# EAGLE design CCM_0008 (EAGLE 9.5.1)
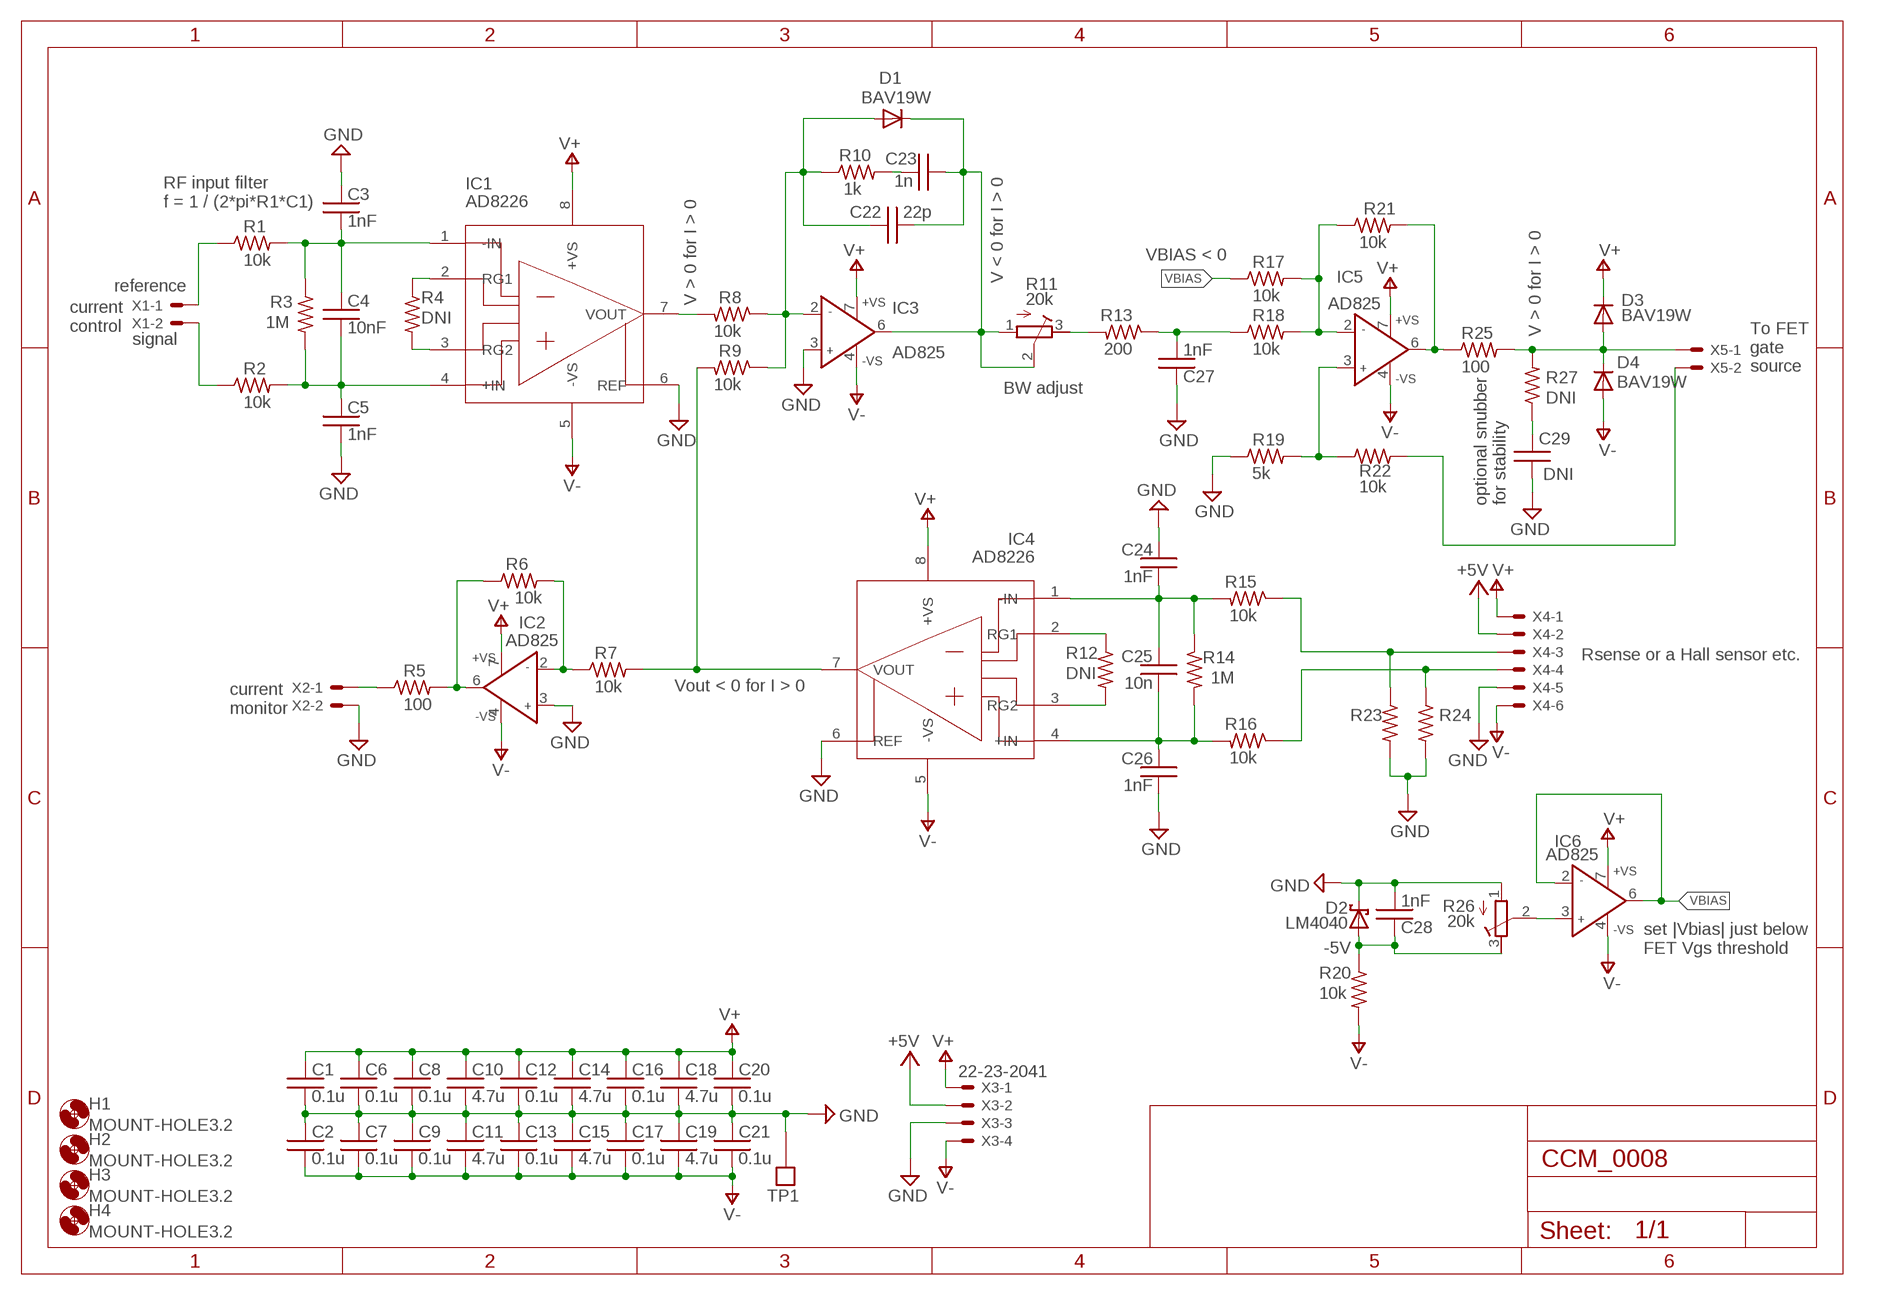
[diagram p0: schematic, sheet 1]

## Parts
C1  0.1u  C0603  [0603]
C2  0.1u  C0603  [0603]
C3  1nF  C0603  [0603]
C4  10nF  C0603  [0603]
C5  1nF  C0603  [0603]
C6  0.1u  C0603  [0603]
C7  0.1u  C0603  [0603]
C8  0.1u  C0603  [0603]
C9  0.1u  C0603  [0603]
C10  4.7u  C0603  [0603]
C11  4.7u  C0603  [0603]
C12  0.1u  C0603  [0603]
C13  0.1u  C0603  [0603]
C14  4.7u  C0603  [0603]
C15  4.7u  C0603  [0603]
C16  0.1u  C0603  [0603]
C17  0.1u  C0603  [0603]
C18  4.7u  C0603  [0603]
C19  4.7u  C0603  [0603]
C20  0.1u  C0603  [0603]
C21  0.1u  C0603  [0603]
C22  22p  C0603  [0603]
C23  1n  C0603  [0603]
C24  1nF  C0603  [0603]
C25  10n  C0603  [0603]
C26  1nF  C0603  [0603]
C27  1nF  C0603  [0603]
C28  1nF  C0603  [0603]
C29  DNI  C0603  [0603]
D1  BAV19W  DIODE-SOD123  [SOD123]
D2  LM4040  [SOT23]
D3  BAV19W  DIODE-SOD123  [SOD123]
D4  BAV19W  DIODE-SOD123  [SOD123]
H1  MOUNT-HOLE3.2  [3,2]
H2  MOUNT-HOLE3.2  [3,2]
H3  MOUNT-HOLE3.2  [3,2]
H4  MOUNT-HOLE3.2  [3,2]
IC1  AD8226  [SO08]
IC2  AD825  AD825_BR  [SO8]
IC3  AD825  AD825_BR  [SO8]
IC4  AD8226  [SO08]
IC5  AD825  AD825_BR  [SO8]
IC6  AD825  AD825_BR  [SO8]
R1  10k  R0603  [0603]
R2  10k  R0603  [0603]
R3  1M  R0603  [0603]
R4  DNI  R0603  [0603]
R5  100  R0603  [0603]
R6  10k  R0603  [0603]
R7  10k  R0603  [0603]
R8  10k  R0603  [0603]
R9  10k  R0603  [0603]
R10  1k  R0603  [0603]
R11  20k  R-TRIMM3224W  [RTRIM3224W]
R12  DNI  R0603  [0603]
R13  200  R0603  [0603]
R14  1M  R0603  [0603]
R15  10k  R0603  [0603]
R16  10k  R0603  [0603]
R17  10k  R0603  [0603]
R18  10k  R0603  [0603]
R19  5k  R0603  [0603]
R20  10k  R0603  [0603]
R21  10k  R0603  [0603]
R22  10k  R0603  [0603]
R23  ***  R0603  [0603]
R24  ***  R0603  [0603]
R25  100  R0603  [0603]
R26  20k  R-TRIMM3224W  [RTRIM3224W]
R27  DNI  R0603  [0603]
TP1  TESTPOINT  [TESTPOINT]
X1  22-23-2021  [22-23-2021]
X2  22-23-2021  [22-23-2021]
X3  22-23-2041  [22-23-2041]
X4  22-23-2061  [22-23-2061]
X5  22-23-2021  [22-23-2021]

## Nets
+5V: X3.2 X4.2
GND: C1.2 C2.1 C3.1 C5.2 C6.2 C7.1 C8.2 C9.1 C10.2 C11.1 C12.2 C13.1 C14.2 C15.1 C16.2 C17.1 C18.2 C19.1 C20.2 C21.1 C24.1 C26.2 C27.1 C28.2 C29.2 D2.1(C) IC1.6(REF) IC2.3(IN+) IC3.3(IN+) IC4.6(REF) R19.1 R23.2 R24.2 R26.1(A) TP1.P$1 X2.2 X3.3 X4.5
N$1: R2.1 X1.2
N$2: R1.1 X1.1
N$3: C22.1 C23.1 D1.C IC3.6(OUT) R11.1(A) R11.2(S)
N$4: IC1.2(RG1) R4.1
N$5: C3.2 C4.1 IC1.1(-IN) R1.2 R3.1
N$6: C4.2 C5.1 IC1.4(+IN) R2.2 R3.2
N$7: R5.1 X2.1
N$8: IC1.3(RG2) R4.2
N$9: IC2.6(OUT) R5.2 R6.1
N$10: IC2.2(IN-) R6.2 R7.1
N$11: IC5.3(IN+) R19.2 R22.1
N$12: IC4.7(VOUT) R7.2 R9.2
N$13: C27.2 R13.1 R18.1
N$14: IC5.2(IN-) R17.2 R18.2 R21.1
N$15: IC1.7(VOUT) R8.2
N$16: IC5.6(OUT) R21.2 R25.1
N$17: R11.3(E) R13.2
N$18: R22.2 X5.2
N$19: D3.A D4.C R25.2 R27.2 X5.1
N$20: C28.1 D2.2(A) R20.1 R26.3(E)
N$21: R16.1 R24.1 X4.4
N$22: IC6.3(IN+) R26.2(S)
N$23: IC4.2(RG1) R12.1
N$24: IC4.3(RG2) R12.2
N$25: C24.2 C25.1 IC4.1(-IN) R14.1 R15.2
N$26: C25.2 C26.1 IC4.4(+IN) R14.2 R16.2
N$27: R15.1 R23.1 X4.3
N$28: C29.1 R27.1
N$30: C23.2 R10.2
N$33: C22.2 D1.A IC3.2(IN-) R8.1 R9.1 R10.1
V+: C1.1 C6.1 C8.1 C10.1 C12.1 C14.1 C16.1 C18.1 C20.1 D3.C IC1.8(+VS) IC2.7(+VS) IC3.7(+VS) IC4.8(+VS) IC5.7(+VS) IC6.7(+VS) X3.1 X4.1
V-: C2.2 C7.2 C9.2 C11.2 C13.2 C15.2 C17.2 C19.2 C21.2 D4.A IC1.5(-VS) IC2.4(-VS) IC3.4(-VS) IC4.5(-VS) IC5.4(-VS) IC6.4(-VS) R20.2 X3.4 X4.6
VBIAS: IC6.2(IN-) IC6.6(OUT) R17.1

## Notes on the sheet
- RF input filter 
  f = 1 / (2*pi*R1*C1)
- VBIAS < 0
- V < 0 for I > 0
- reference
- V > 0 for I > 0
- current
  control
- V > 0 for I > 0
- signal
- To FET
  gate
  source
- BW adjust
- optional snubber
  for stability
- Rsense or a Hall sensor etc.
- Vout < 0 for I > 0
- current
  monitor
- -5V
- set |Vbias| just below 
  FET Vgs threshold

## Library data of the parts
C1-C29 = acrooptics:C: Capacitor
D1 D3 D4 = AquariumLibrary:DIODE-: DIODE
D2 = noah:LM4040: LM4040 Reference Zener Diode
H1-H4 = holes:MOUNT-HOLE: MOUNTING HOLE with drill center marker
IC1 IC4 = noah:AD8226
IC2 IC3 IC5 IC6 = noah:AD825_B: Low Cost, General-Purpose High Speed JFET Amplifier Source: http://www.analog.com/static/imported-files/data_sheets/AD825.pdf; MF: ALTERA CORPORATION; MPN: AD825ARZ; OC_FARNELL: 9603735; OC_NEWARK: 59K6528
R1-R10 R12-R25 R27 = acrooptics:R: 0603 resistor
R11 R26 = resistor:R-TRIMM: Trimm resistor
TP1 = Fitch:TESTPOINT
X1 X2 X5 = con-molex:22-23-2021: .100" (2.54mm) Center Header - 2 Pin; MF: MOLEX; MPN: 22-23-2021; OC_FARNELL: 1462926; OC_NEWARK: 25C3832
X3 = con-molex:22-23-2041: .100" (2.54mm) Center Header - 4 Pin; MF: MOLEX; MPN: 22-23-2041; OC_FARNELL: 1462920; OC_NEWARK: 38C0355
X4 = con-molex:22-23-2061: .100" (2.54mm) Center Header - 6 Pin; MF: MOLEX; MPN: 22-23-2061; OC_FARNELL: 1462922; OC_NEWARK: 27C1933

## Net classes
1 standard: width 0.61 mm, clearance 0.254 mm

## Board
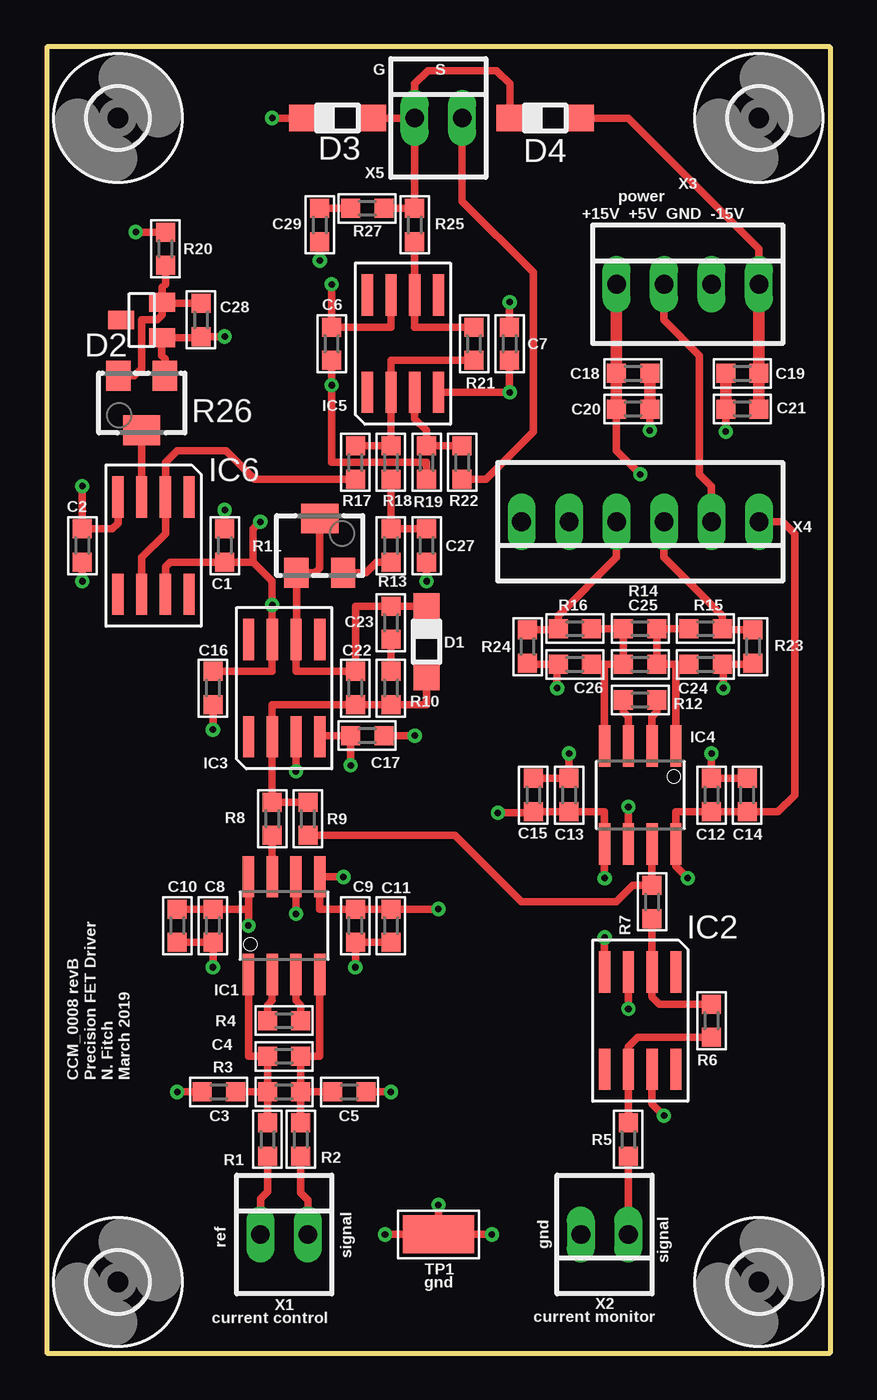
[diagram p1: board, top side]
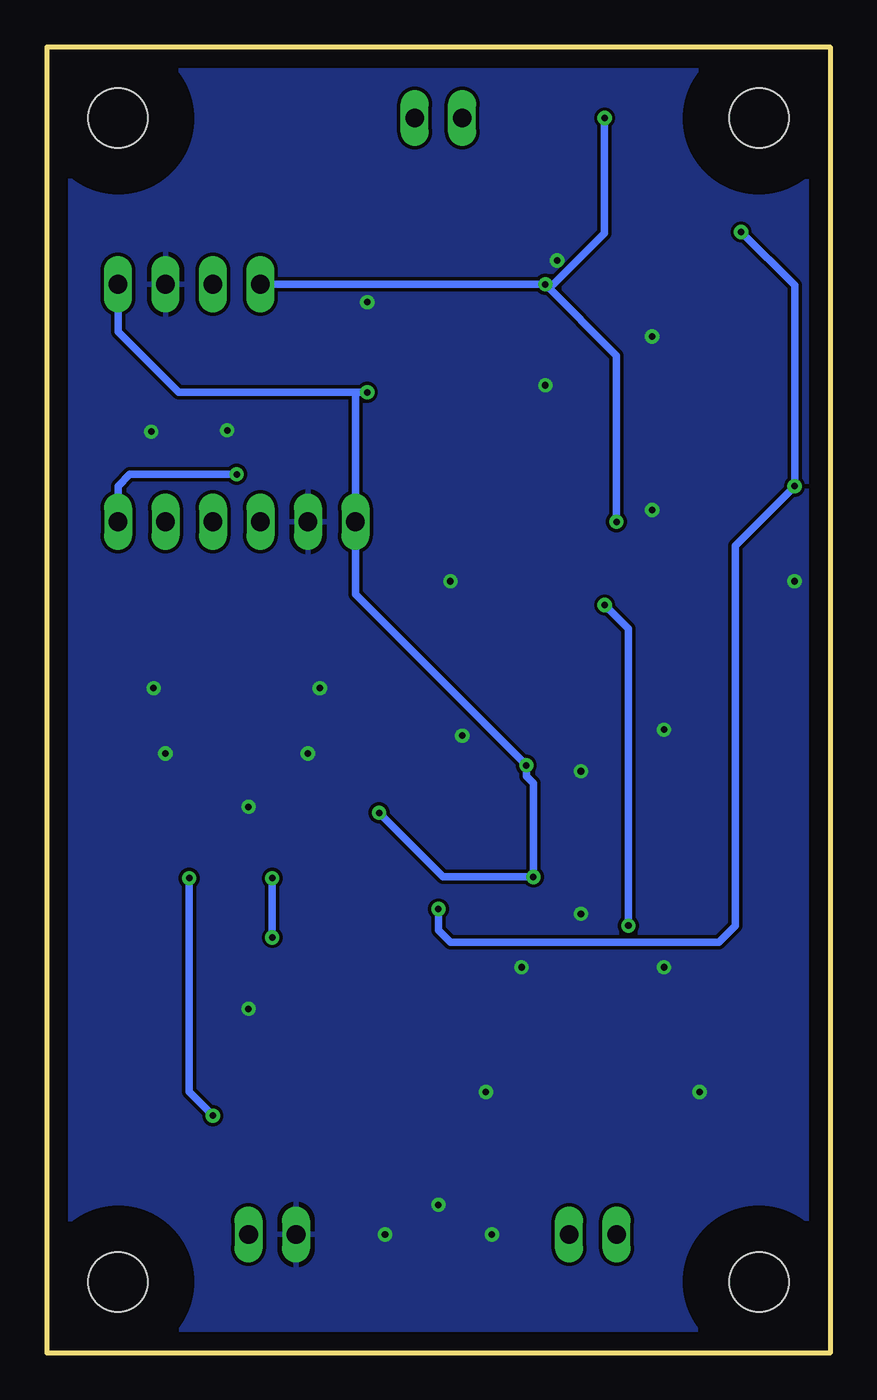
[diagram p2: board, bottom side, seen from below]

Size 41.91 x 69.85 mm. Coordinates in mm from the lower left corner, seen from the top.
Outline: 0,0 41.91,0 41.91,69.85 0,69.85 0,0
Copper layers (1*16): Top 0.035mm / dielectric 1.5mm / Bottom 0.035mm
Design rules "default *": minimum track width 10mil, minimum drill 10mil, track to track 7mil, track to pad 7mil, pad to pad 7mil, via to via 7mil, smd to smd 7mil, copper to edge 10mil, drill to drill 8mil, minimum pad ring 10mil, minimum via ring 8mil, stop-mask expansion 4mil, vias tented up to drill 0mil, thermal gap 10mil

### Footprints (pad centres in the part's own frame; a part is rotated, then mirrored left to right if it is on the bottom)
0603 = smd 1.016 x 1.016: 1 -0.889,0; 2 0.889,0
SOD123 = smd 1.4 x 1.4: A 1.9,0; C -1.9,0
SOT23 = smd 1 x 1.4: 1 -0.95,-1.1; 2 0.95,-1.1; 3 0,1.1
3,2 = hole 3.2: 0,0
SO08 = smd 0.61 x 2.21: 1 -1.905,-2.616; 2 -0.635,-2.616; 3 0.635,-2.616; 4 1.905,-2.616; 5 1.905,2.616; 6 0.635,2.616; 7 -0.635,2.616; 8 -1.905,2.616
SO8 = smd 0.6 x 2.2: 1 -1.905,-2.6; 2 -0.635,-2.6; 3 0.635,-2.6; 4 1.905,-2.6; 5 1.905,2.6; 6 0.635,2.6; 7 -0.635,2.6; 8 -1.905,2.6
RTRIM3224W = smd 1.3 x 1.6: 1 -1.25,-1.45; 3 1.25,-1.45 | smd 2 x 1.6: 2 0,1.45
TESTPOINT = smd 3.81 x 2.032: P$1 0,0
22-23-2021 = drill 1 long: 1 -1.27,0; 2 1.27,0
22-23-2041 = drill 1 long: 1 -3.81,0; 2 -1.27,0; 3 1.27,0; 4 3.81,0
22-23-2061 = drill 1 long: 1 -6.35,0; 2 -3.81,0; 3 -1.27,0; 4 1.27,0; 5 3.81,0; 6 6.35,0

### Placement (x,y rotation side)
C1  9.53,43.18 90 top
C2  1.91,43.18 90 top
C3  9.21,13.97 0 top
C4  12.7,15.88 0 top
C5  16.19,13.97 0 top
C6  15.24,53.98 270 top
C7  24.77,53.98 270 top
C8  8.89,22.86 270 top
C9  16.51,22.86 90 top
C10  6.99,22.86 270 top
C11  18.41,22.86 90 top
C12  35.56,29.84 90 top
C13  27.94,29.84 270 top
C14  37.47,29.84 90 top
C15  26.04,29.84 270 top
C16  8.89,35.56 270 top
C17  17.14,33.02 180 top
C18  31.37,52.39 0 top
C19  37.21,52.39 0 top
C20  31.37,50.48 0 top
C21  37.21,50.48 0 top
C22  16.51,35.56 270 top
C23  18.41,39.05 270 top
C24  35.24,36.83 180 top
C25  31.75,36.83 180 top
C26  28.26,36.83 180 top
C27  20.32,43.18 90 top
C28  8.26,55.24 270 top
C29  14.61,60.33 270 top
D1  20.32,38.04 270 top
D2  5.08,55.24 90 top
D3  15.56,66.04 0 top
D4  26.67,66.04 0 top
H1  3.81,3.81 0 top
H2  3.81,66.04 0 top
H3  38.1,3.81 0 top
H4  38.1,66.04 0 top
IC1  12.7,22.86 0 top
IC2  31.75,17.78 180 top
IC3  12.7,35.56 0 top
IC4  31.75,29.84 180 top
IC5  19.05,53.98 0 top
IC6  5.71,43.18 180 top
R1  11.81,11.43 90 top
R2  13.59,11.43 90 top
R3  12.7,13.97 0 top
R4  12.7,17.78 0 top
R5  31.11,11.43 90 top
R6  35.56,17.78 90 top
R7  32.38,24.13 90 top
R8  12.06,28.57 270 top
R9  13.97,28.57 270 top
R10  18.41,35.56 90 top
R11  14.61,43.18 0 top
R12  31.75,34.92 180 top
R13  18.41,43.18 270 top
R14  31.75,38.73 180 top
R15  35.24,38.73 180 top
R16  28.26,38.73 0 top
R17  16.51,47.62 90 top
R18  18.41,47.62 90 top
R19  20.32,47.62 90 top
R20  6.35,59.05 90 top
R21  22.86,53.98 90 top
R22  22.23,47.62 270 top
R23  37.78,37.78 270 top
R24  25.72,37.78 270 top
R25  19.68,60.33 90 top
R26  5.08,50.8 180 top
R27  17.14,61.21 0 top
TP1  20.95,6.35 0 top
X1  12.7,6.35 0 top
X2  29.84,6.35 180 top
X3  34.29,57.15 0 top
X4  31.75,44.45 180 top
X5  20.95,66.04 0 top

### Tracks (layer width: path | path; a pad name or v marks a point on that pad's centre or on a via)
+5V
  Top 0.406: X3.2 33.02,55.24 34.92,53.34 34.92,46.99 35.56,46.35 X4.2
GND  (via drill 0.35)
  Top 0.406: IC1.6 v13.34,23.5 | C5.2 v18.41,13.97 | C3.1 v6.99,13.97 | v16.51,20.64 C9.1 C11.1 | v8.89,20.64 C8.2 C10.2 | C6.2 v15.24,51.75 15.24,47.62 20.32,47.62 R19.1 | C7.1 v24.77,56.2 | C29.2 v14.61,58.42 | v27.94,32.07 C13.1 C15.1 | v35.56,32.07 C12.2 C14.2 | R24.2 25.78,36.83 C26.2 27.3,36.77 v27.3,35.56 | R23.2 37.72,36.83 C24.1 36.2,36.77 v36.2,35.56 | IC4.6 v31.11,29.21 | TP1.P$1 v18.1,6.35 | TP1.P$1 v20.95,7.94 | TP1.P$1 v23.81,6.35 | IC3.3 v13.34,31.11 | C16.2 v8.89,33.34 | C17.1 v19.68,33.02 | IC2.3 v31.11,18.41 | C27.1 v20.32,41.27 | v9.53,54.36 C28.2 8.19,54.3 D2.1 6.16,54.27 6.16,53.34 6.33,53.17 R26.1 | C21.1 v36.32,49.28 | C20.2 v32.26,49.34 | C2.1 v1.91,41.27 | C1.2 v9.53,45.09
  Top 0.61: C18.2 C20.2 | C21.1 C19.1
  pour Bottom: 1.27,1.27 1.27,68.58 40.64,68.58 40.64,1.27
N$1
  Top 0.406: R2.1 13.59,8.57 13.97,8.19 X1.2
N$2
  Top 0.406: R1.1 11.81,8.64 11.43,8.26 X1.1
N$3
  Top 0.406: D1.C C23.1 16.51,39.94 C22.1 13.34,36.45 IC3.6 13.36,38.18 R11.1 14.35,41.72 14.61,41.97 R11.2
N$4
  Top 0.406: IC1.2 12.06,18.86 11.81,18.61 R4.1
N$5
  Top 0.406: IC1.1 10.79,15.88 C4.1 R3.1 | C3.2 R3.1 | R3.1 R1.2
N$6
  Top 0.406: IC1.4 14.61,15.88 C4.2 R3.2 | R3.2 C5.1 | R3.2 R2.2
N$7
  Top 0.406: R5.1 X2.1
N$8
  Top 0.406: IC1.3 13.34,18.86 13.59,18.61 R4.2
N$9
  Top 0.406: R5.2 IC2.6 31.11,16.38 31.62,16.89 R6.1
N$10
  Top 0.406: R7.1 IC2.2 32.38,19.05 32.77,18.67 R6.2
N$11
  Top 0.406: IC5.3 19.68,49.97 20.32,49.34 R19.2 R22.1
N$12
  Top 0.406: IC4.7 R7.2 31.37,25.02 30.48,24.13 25.4,24.13 21.84,27.69 R9.2
N$13
  Top 0.406: C27.2 R13.1 R18.1
N$14
  Top 0.406: R21.1 18.41,53.09 IC5.2 R18.2 R17.2
N$15
  Top 0.406: R8.2 IC1.7
N$16
  Top 0.406: R21.2 19.68,54.86 IC5.6 R25.1
N$17
  Top 0.406: R13.2 17.65,42.29 17.08,41.72 R11.3
N$18
  Top 0.406: X5.2 22.23,61.59 26.04,57.78 26.04,49.28 23.5,46.74 R22.2
N$19
  Top 0.406: R27.2 R25.2 X5.1 | D3.A X5.1 | D4.C 24.77,67.88 24.07,68.58 20.38,68.58 19.68,67.88 X5.1
N$20
  Top 0.406: D2.2 6.18,56.98 6.35,57.15 R20.1 | C28.1 6.24,56.13 D2.2 | D2.2 6.18,55.52 5.91,55.24 5.08,55.24 5.08,52.64 4.69,52.25 R26.3
N$21
  Top 0.406: R24.1 27.3,38.67 R16.1 27.37,39.43 30.48,42.55 X4.4
N$22
  Top 0.406: R26.2 IC6.3
N$23
  Top 0.406: IC4.2 32.38,34.04 32.64,34.29 R12.1
N$24
  Top 0.406: IC4.3 31.11,34.04 30.86,34.29 R12.2
N$25
  Top 0.406: 33.66,36.83 C25.1 R14.1 R15.2 | 33.66,36.83 C24.2 | IC4.1 33.66,36.83
N$26
  Top 0.406: 29.84,36.83 C25.2 R14.2 R16.2 | 29.84,36.83 C26.1 | IC4.4 29.84,36.83
N$27
  Top 0.406: R23.1 36.2,38.67 R15.1 36.13,39.43 33.02,42.55 X4.3
N$28
  Top 0.406: R27.1 C29.1
N$30
  Top 0.406: C23.2 R10.2
N$33
  Top 0.406: D1.A 20.32,34.67 R10.1 C22.2 12.06,34.67 IC3.2 R8.1 R9.1
V+  (via drill 0.35)
  Top 0.406: IC1.8 10.79,23.75 | 10.79,23.75 C8.1 C10.1 | IC5.7 18.41,54.86 C6.1 v15.24,57.15 | C16.1 12.06,36.45 IC3.7 v12.06,40.01 12.06,41.27 11.05,42.29 | 10.79,23.75 v10.79,22.86 | v34.29,25.4 33.66,26.04 IC4.8 33.66,28.96 C12.1 C14.1 39.12,28.96 40.01,29.84 40.01,43.81 39.37,44.45 X4.1 | v33.02,12.7 32.38,13.34 IC2.7 | IC6.7 6.35,42.04 6.6,42.29 C1.1 11.05,42.29 | v12.06,66.04 D3.C | 11.05,42.29 11.05,44.07 v11.43,44.45 | C20.1 30.48,48.26 v31.75,46.99
  Top 0.61: X3.1 C18.1 C20.1
  Bottom 0.406: v34.29,25.4 34.29,13.97 v33.02,12.7 | v12.06,40.01 10.79,38.73 v10.79,22.86 | v15.24,57.15 14.8,57.15 12.06,59.89 v12.06,66.04 | X3.1 v15.24,57.15 | v11.43,44.45 11.43,53.34 v15.24,57.15 | X4.1 38.1,46.35 37.47,46.99 v31.75,46.99
V-  (via drill 0.35)
  Top 0.406: C7.2 v24.77,51.38 IC5.4 | IC3.4 14.61,33.02 C17.2 v16.26,31.43 | v15.88,25.46 15.86,25.48 IC1.5 14.61,23.75 C9.2 C11.2 v20.95,23.75 | v29.84,25.4 IC4.5 29.84,28.96 C13.2 C15.2 25.97,28.89 v24.13,28.89 | v29.84,22.23 IC2.4 | IC6.4 3.81,44.39 3.49,44.07 C2.2 v1.91,46.35 | D4.A 31.11,66.04 38.1,59.05 X3.4 | v4.76,59.94 R20.2
  Top 0.61: C21.2 C19.2 X3.4
  Bottom 0.406: v29.84,25.4 v29.84,22.23 | v24.13,28.89 20.7,25.46 v15.88,25.46 15.88,30.48 16.26,30.86 v16.26,31.43 25.4,40.58 X4.6 25.4,51.38 | X3.4 38.1,54.61 34.87,51.38 25.4,51.38 | 25.4,51.38 v24.77,51.38 | v4.76,59.94 1.91,57.09 v1.91,46.35 5.08,43.18 5.08,22.86 5.97,21.97 20.32,21.97 20.95,22.61 v20.95,23.75
VBIAS
  Top 0.406: IC6.6 5.08,42.55 6.35,43.81 IC6.2 6.35,47.62 6.99,48.26 9.59,48.26 11.11,46.74 R17.1

### Text on the board
tPlace: CCM_0008 revB / Precision FET Driver / N. Fitch / March 2019 | gnd
tNames: G S | power / +15V +5V GND -15V | ref | gnd | signal | signal | current control | current monitor